# EAGLE design board_v3 (EAGLE 9.6.2)
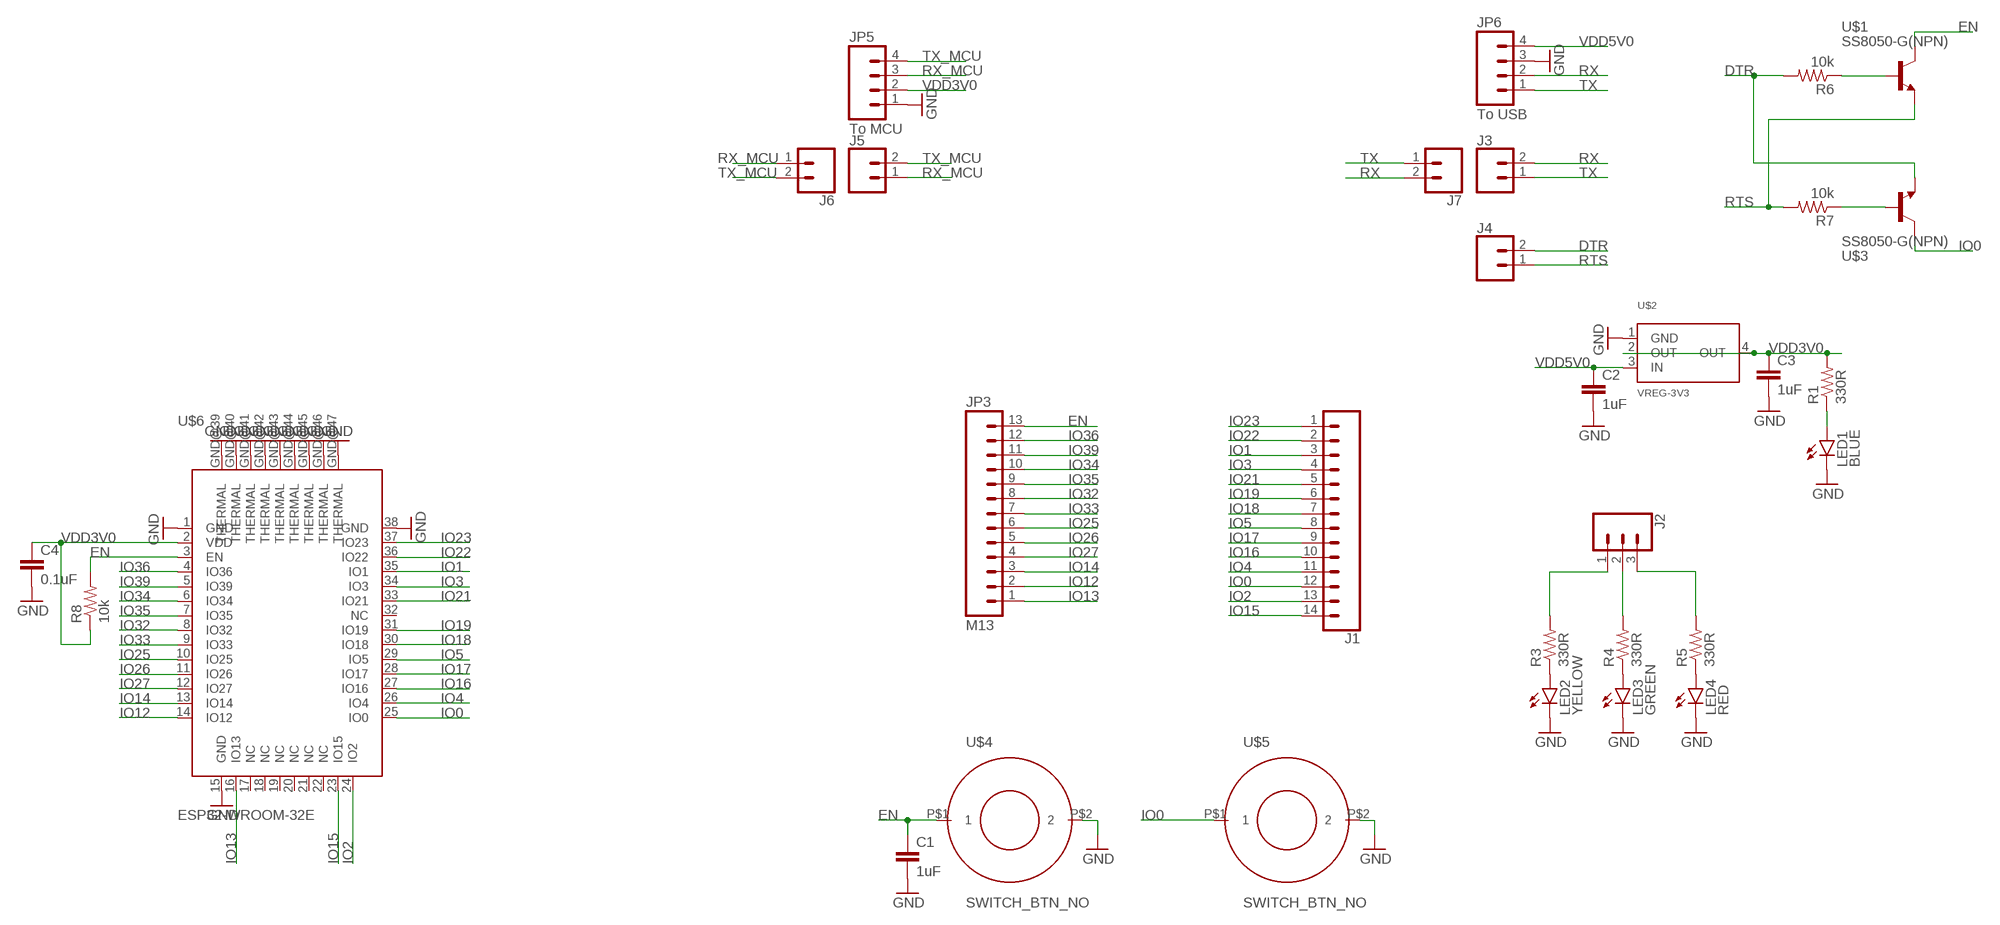
[diagram p0: schematic, sheet 1]

## Parts
C1  1uF  CAP  [0805]
C2  1uF  CAP  [0805]
C3  1uF  CAP  [0805]
C4  0.1uF  CAP  [0805]
J1  CONN_14  [1X14]
J2  CONN_03  [1X03]
J3  CONN_02  [1X02]
J4  CONN_02  [1X02]
J5  CONN_02  [1X02]
J6  CONN_02  [1X02]
J7  CONN_02  [1X02]
JP3  M13  [1X13]
JP5  To MCU  M04PTH  [1X04]
JP6  To USB  M04PTH  [1X04]
LED1  BLUE  LED0603  [LED-0603]
LED2  YELLOW  LED0603  [LED-0603]
LED3  GREEN  LED0603  [LED-0603]
LED4  RED  LED0603  [LED-0603]
R1  330R  RES  [0805]
R3  330R  RES  [0805]
R4  330R  RES  [0805]
R5  330R  RES  [0805]
R6  10k  RES  [0805]
R7  10k  RES  [0805]
R8  10k  RES  [0805]
U$1  SS8050-G(NPN)  [SOT-23(SS8050-G)]
U$2  VREG-3V3  [R-PDSO-G4_TI]
U$3  SS8050-G(NPN)  [SOT-23(SS8050-G)]
U$4  SWITCH_BTN_NO  [BTN_2]
U$5  SWITCH_BTN_NO  [BTN_2]
U$6  ESP32-WROOM-32E  [ESP32-WROOM-32E]

## Nets
DTR: J4.2 R6.2 U$3.2(E)
EN: C1.1 JP3.13 R8.2 U$1.3(C) U$4.P$1 U$6.3(EN)
GND: C1.2 C2.2 C3.2 C4.2 JP5.1 JP6.3 LED1.C LED2.C LED3.C LED4.C U$2.1(GND) U$4.P$2 U$5.P$2 U$6.1(GND) U$6.15(GND) U$6.38(GND) U$6.GND@39(THERMAL) U$6.GND@40(THERMAL) U$6.GND@41(THERMAL) U$6.GND@42(THERMAL) U$6.GND@43(THERMAL) U$6.GND@44(THERMAL) U$6.GND@45(THERMAL) U$6.GND@46(THERMAL) U$6.GND@47(THERMAL)
IO0: J1.12 U$3.3(C) U$5.P$1 U$6.25(IO0)
IO1: J1.3 U$6.35(IO1)
IO2: J1.13 U$6.24(IO2)
IO3: J1.4 U$6.34(IO3)
IO4: J1.11 U$6.26(IO4)
IO5: J1.8 U$6.29(IO5)
IO12: JP3.2 U$6.14(IO12)
IO13: JP3.1 U$6.16(IO13)
IO14: JP3.3 U$6.13(IO14)
IO15: J1.14 U$6.23(IO15)
IO16: J1.10 U$6.27(IO16)
IO17: J1.9 U$6.28(IO17)
IO18: J1.7 U$6.30(IO18)
IO19: J1.6 U$6.31(IO19)
IO21: J1.5 U$6.33(IO21)
IO22: J1.2 U$6.36(IO22)
IO23: J1.1 U$6.37(IO23)
IO25: JP3.6 U$6.10(IO25)
IO26: JP3.5 U$6.11(IO26)
IO27: JP3.4 U$6.12(IO27)
IO32: JP3.8 U$6.8(IO32)
IO33: JP3.7 U$6.9(IO33)
IO34: JP3.10 U$6.6(IO34)
IO35: JP3.9 U$6.7(IO35)
IO36: JP3.12 U$6.4(IO36)
IO39: JP3.11 U$6.5(IO39)
N$1: LED1.A R1.1
N$2: J2.1 R3.2
N$3: J2.3 R5.2
N$4: J2.2 R4.2
N$7: R6.1 U$1.1(B)
N$8: R7.1 U$3.1(B)
N$13: LED2.A R3.1
N$14: LED3.A R4.1
N$15: LED4.A R5.1
RTS: J4.1 R7.2 U$1.2(E)
RX: J3.2 J7.2 JP6.2
RX_MCU: J5.1 J6.1 JP5.3
TX: J3.1 J7.1 JP6.1
TX_MCU: J5.2 J6.2 JP5.4
VDD3V0: C3.1 C4.1 JP5.2 R1.2 R8.1 U$2.2(OUT) U$2.4(OUT) U$6.2(VDD)
VDD5V0: C2.1 JP6.4 U$2.3(IN)
Unconnected: U$6.17(NC) U$6.18(NC) U$6.19(NC) U$6.20(NC) U$6.21(NC) U$6.22(NC) U$6.32(NC)

## Library data of the parts
C1-C4 = Ilya_Teach:CAP
J1 = SparkFun-Connectors:CONN_14: Multi connection point. Often used as Generic Header-pin footprint for 0.1 inch spaced/style header connections On any of the 0.1 inch spaced packages, you can populate with these: Break Away Headers - Straight <https://www.sparkfun.com/products/116> (PRT-00116) Break Away Male Headers - Right Angle <https://www.sparkfun.com/products/553> (PRT-00553) Female Headers <https://www.sparkfun.com/products/115> (PRT-00115) Break Away Headers - Machine Pin <https://www.sparkfun.com/products/117> (PRT-00117) Break Away Female Headers - Swiss Machine Pin <https://www.sparkfun.com/products/743> (PRT-00743) For SCREWTERMINALS and SPRING TERMINALS visit here: Screw Terimnals on SparkFun.com <https://www.sparkfun.com/search/results?term=Screw+Terminals> (5mm/3.5mm/2.54mm spacing) This device is also useful as a general connection point to wire up your design to another part of your project. Our various solder wires solder well into these plated through hole pads. Hook-Up Wire - Assortment (Stranded, 22 AWG) <https://www.sparkfun.com/products/11375> (PRT-11375) Hook-Up Wire - Assortment (Solid Core, 22 AWG) <https://www.sparkfun.com/products/11367> (PRT-11367) View the entire wire category on our website here <https://www.sparkfun.com/categories/141> Special notes: Molex polarized connector foot print use with SKU : PRT-08231 with associated crimp pins and housings. 1MM SMD Version SKU: PRT-10208 NOTES ON THE VARIANTS LOCK and LOCK_LONGPADS... This footprint was designed to help hold the alignment of a through-hole component (i.e. 6-pin header) while soldering it into place. You may notice that each hole has been shifted either up or down by 0.005 of an inch from it's more standard position (which is a perfectly straight line). This slight alteration caused the pins (the squares in the middle) to touch the edges of the holes. Because they are alternating, it causes a "brace" to hold the component in place. 0.005 has proven to be the perfect amount of "off-center" position when using our standard breakaway headers. Although looks a little odd when you look at the bare footprint, once you have a header in there, the alteration is very hard to notice. Also,if you push a header all the way into place, it is covered up entirely on the bottom side.
J2 = SparkFun-Connectors:CONN_03: Multi connection point. Often used as Generic Header-pin footprint for 0.1 inch spaced/style header connections On any of the 0.1 inch spaced packages, you can populate with these: Break Away Headers - Straight <https://www.sparkfun.com/products/116> (PRT-00116) Break Away Male Headers - Right Angle <https://www.sparkfun.com/products/553> (PRT-00553) Female Headers <https://www.sparkfun.com/products/115> (PRT-00115) Break Away Headers - Machine Pin <https://www.sparkfun.com/products/117> (PRT-00117) Break Away Female Headers - Swiss Machine Pin <https://www.sparkfun.com/products/743> (PRT-00743) Stackable Header - 3 Pin (Female, 0.1") <https://www.sparkfun.com/products/13875> (PRT-13875) For SCREWTERMINALS and SPRING TERMINALS visit here: Screw Terimnals on SparkFun.com <https://www.sparkfun.com/search/results?term=Screw+Terminals> (5mm/3.5mm/2.54mm spacing) This device is also useful as a general connection point to wire up your design to another part of your project. Our various solder wires solder well into these plated through hole pads. Hook-Up Wire - Assortment (Stranded, 22 AWG) <https://www.sparkfun.com/products/11375> (PRT-11375) Hook-Up Wire - Assortment (Solid Core, 22 AWG) <https://www.sparkfun.com/products/11367> (PRT-11367) View the entire wire category on our website here <https://www.sparkfun.com/categories/141> Special notes: Molex polarized connector foot print use with SKU : PRT-08232 with associated crimp pins and housings.
J3-J7 = SparkFun-Connectors:CONN_02: Multi connection point. Often used as Generic Header-pin footprint for 0.1 inch spaced/style header connections On any of the 0.1 inch spaced packages, you can populate with these: Break Away Headers - Straight <https://www.sparkfun.com/products/116> (PRT-00116) Break Away Male Headers - Right Angle <https://www.sparkfun.com/products/553> (PRT-00553) Female Headers <https://www.sparkfun.com/products/115> (PRT-00115) Break Away Headers - Machine Pin <https://www.sparkfun.com/products/117> (PRT-00117) Break Away Female Headers - Swiss Machine Pin <https://www.sparkfun.com/products/743> (PRT-00743) For SCREWTERMINALS and SPRING TERMINALS visit here: Screw Terimnals on SparkFun.com <https://www.sparkfun.com/search/results?term=Screw+Terminals> (5mm/3.5mm/2.54mm spacing) This device is also useful as a general connection point to wire up your design to another part of your project. Our various solder wires solder well into these plated through hole pads. Hook-Up Wire - Assortment (Stranded, 22 AWG) <https://www.sparkfun.com/products/11375> (PRT-11375) Hook-Up Wire - Assortment (Solid Core, 22 AWG) <https://www.sparkfun.com/products/11367> (PRT-11367) View the entire wire category on our website here <https://www.sparkfun.com/categories/141> Special notes: Molex polarized connector foot print use with: PRT-08233 with associated crimp pins and housings. 2.54_SCREWTERM for use with PRT-10571. 3.5mm Screw Terminal footprints for PRT-08084 5mm Screw Terminal footprints for use with PRT-08432
JP3 = SparkFun:M13
JP5 JP6 = SparkFun:M04: Header 4 Standard 4-pin 0.1" header. Use with straight break away headers (SKU : PRT-00116), right angle break away headers (PRT-00553), swiss pins (PRT-00743), machine pins (PRT-00117), and female headers (PRT-00115). Molex polarized connector foot print use with SKU : PRT-08231 with associated crimp pins and housings. 1MM SMD Version SKU: PRT-10208
LED1-LED4 = Ilya_Teach:LED: LEDs Standard schematic elements and footprints for 5mm, 3mm, 1206, and 0603 sized LEDs. 5mm - Spark Fun Electronics SKU : COM-00529 (and others)
R1 R3-R8 = Ilya_Teach:RES
U$1 U$3 = Ilya_Teach:SS8050-G(NPN)
U$2 = Ilya_Teach:VREG-3V3
U$4 U$5 = Ilya_Teach:SWITCH_BTN_NO
U$6 = Ilya_Teach:ESP32-WROOM-32E

## Board
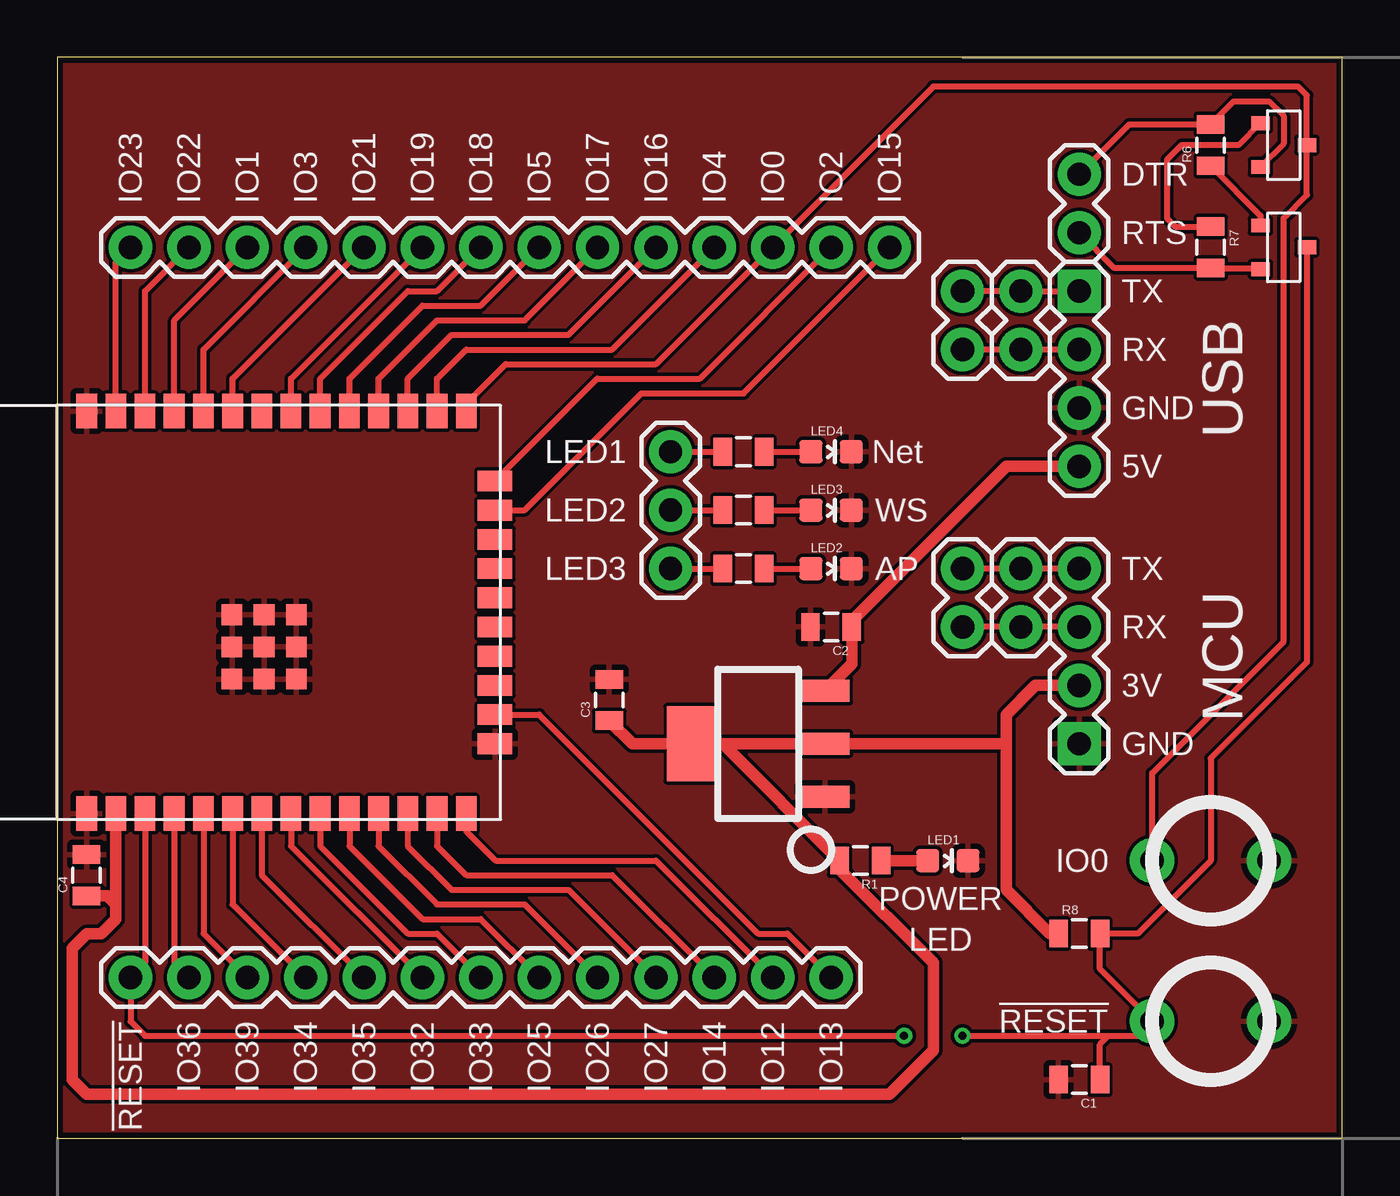
[diagram p1: board, top side]
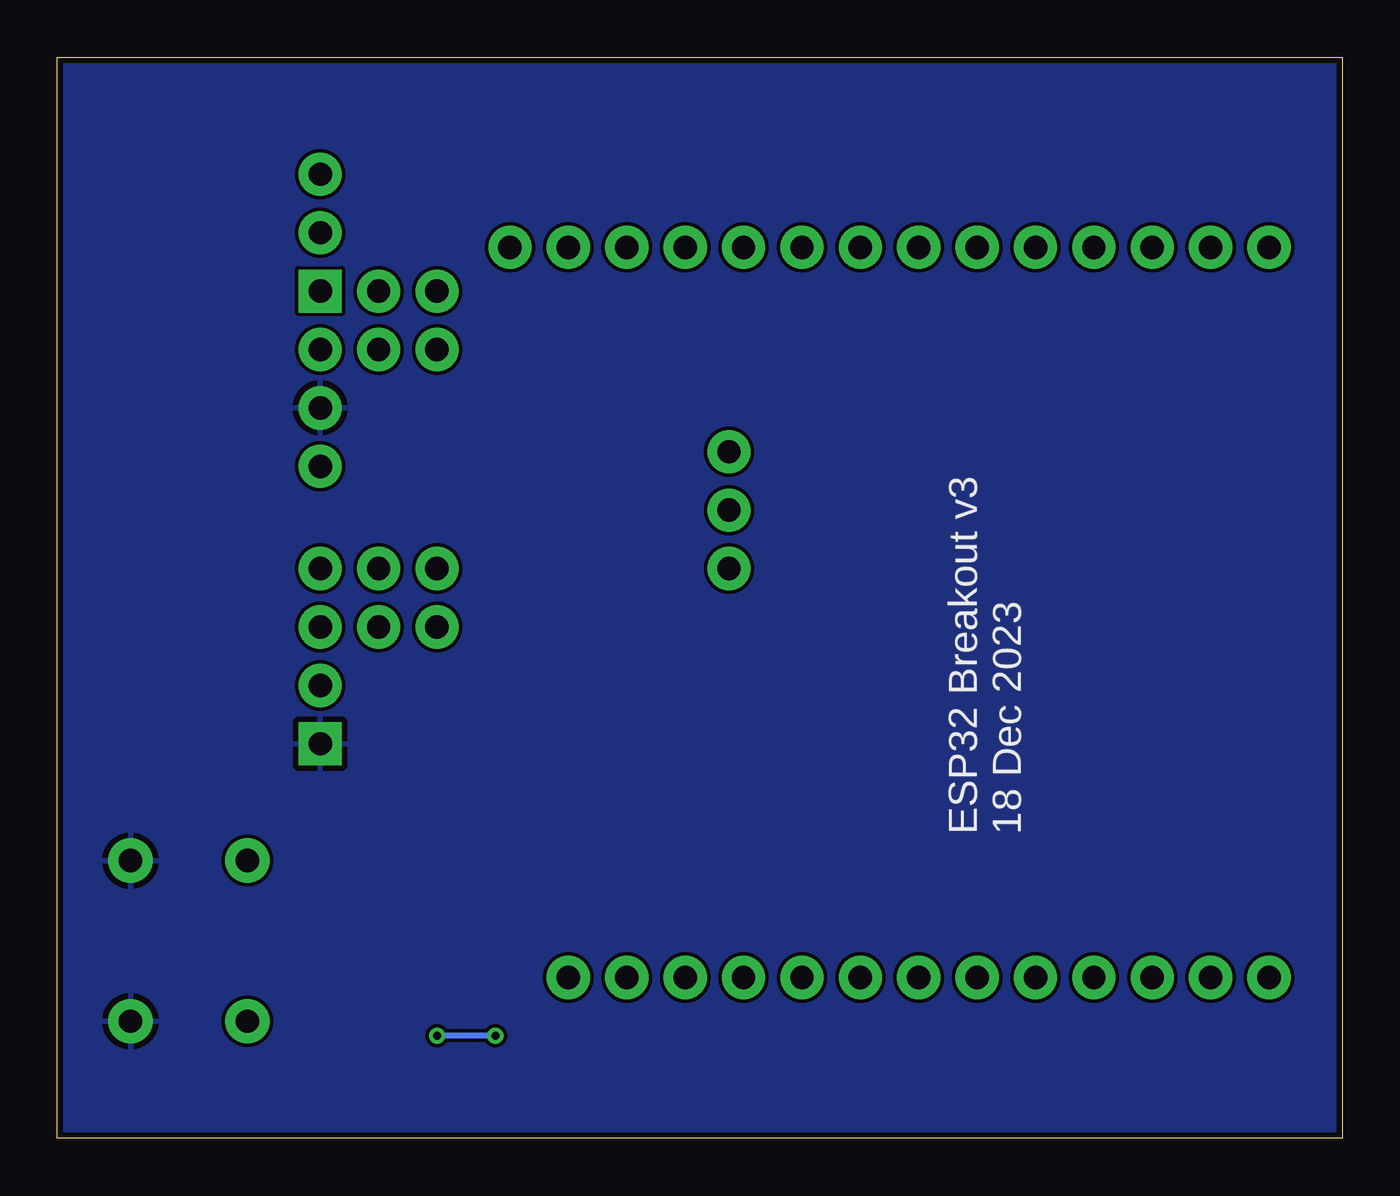
[diagram p2: board, bottom side, seen from below]

Size 55.88 x 46.99 mm. Coordinates in mm from the lower left corner, seen from the top.
Outline: 0,0 55.88,0 55.88,46.99 0,46.99 0,0
Copper layers (1*16): Top 0.0356mm / dielectric 1.5011mm / Bottom 0.0356mm
Design rules "LaenPCBOrder *": minimum track width 6mil, minimum drill 13mil, track to track 6mil, track to pad 6mil, pad to pad 6mil, via to via 6mil, smd to smd 6mil, copper to edge 10mil, drill to drill 6mil, minimum pad ring 7mil, minimum via ring 7mil, stop-mask expansion 4mil, vias tented up to drill 0mil, thermal gap 10mil

### Footprints (pad centres in the part's own frame; a part is rotated, then mirrored left to right if it is on the bottom)
0805 = smd 0.8 x 1.2: 1 -0.9,0; 2 0.9,0
1X14 = drill 1.016 pad 1.88: 1 0,0; 2 2.54,0; 3 5.08,0; 4 7.62,0; 5 10.16,0; 6 12.7,0; 7 15.24,0; 8 17.78,0; 9 20.32,0; 10 22.86,0; 11 25.4,0; 12 27.94,0; 13 30.48,0; 14 33.02,0
1X03 = drill 1.016 pad 1.88: 1 0,0; 2 2.54,0; 3 5.08,0
1X02 = drill 1.016 pad 1.88: 1 0,0; 2 2.54,0
1X13 = drill 1.016 pad 1.88: 1 0,0; 2 2.54,0; 3 5.08,0; 4 7.62,0; 5 10.16,0; 6 12.7,0; 7 15.24,0; 8 17.78,0; 9 20.32,0; 10 22.86,0; 11 25.4,0; 12 27.94,0; 13 30.48,0
1X04 = drill 1.016 pad 1.88 square: 1 0,0 | drill 1.016 pad 1.88: 2 2.54,0; 3 5.08,0; 4 7.62,0
LED-0603 = smd 1 x 1: A 0,-0.877; C 0,0.877
SOT-23(SS8050-G) = smd 0.6 x 0.8: 1 -0.95,-1.01; 2 0.95,-1.01; 3 0,1.01
R-PDSO-G4_TI = smd 0.95 x 2.15: 1 -2.3,-2.9; 2 0,-2.9; 3 2.3,-2.9 | smd 3.25 x 2.15: 4 0,2.9
BTN_2 = drill 1.016 pad 1.93: P$1 -2.54,0; P$2 2.54,0
ESP32-WROOM-32E = smd 1.5 x 0.9: 1 -8.75,8.255; 2 -8.75,6.985; 3 -8.75,5.715; 4 -8.75,4.445; 5 -8.75,3.175; 6 -8.75,1.905; 7 -8.75,0.635; 8 -8.75,-0.635; 9 -8.75,-1.905; 10 -8.75,-3.175; 11 -8.75,-4.445; 12 -8.75,-5.715; 13 -8.75,-6.985; 14 -8.75,-8.255; 25 8.75,-8.255; 26 8.75,-6.985; 27 8.75,-5.715; 28 8.75,-4.445; 29 8.75,-3.175; 30 8.75,-1.905; 31 8.75,-0.635; 32 8.75,0.635; 33 8.75,1.905; 34 8.75,3.175; 35 8.75,4.445; 36 8.75,5.715; 37 8.75,6.985; 38 8.75,8.255 | smd 0.9 x 1.5: 15 -5.715,-9.505; 16 -4.445,-9.505; 17 -3.175,-9.505; 18 -1.905,-9.505; 19 -0.635,-9.505; 20 0.635,-9.505; 21 1.905,-9.505; 22 3.175,-9.505; 23 4.445,-9.505; 24 5.715,-9.505 | smd 0.9 x 0.9: GND@39 -2.9,1.935; GND@40 -1.5,1.935; GND@41 -0.1,1.935; GND@42 -2.9,0.535; GND@43 -1.5,0.535; GND@44 -0.1,0.535; GND@45 -2.9,-0.865; GND@46 -1.5,-0.865; GND@47 -0.1,-0.865

### Placement (x,y rotation side)
C1  44.45,2.54 180 top
C2  33.66,22.23 180 top
C3  24,19.05 90 top
C4  1.27,11.43 90 top
J1  3.17,38.73 0 top
J2  26.67,24.77 90 top
J3  41.91,36.83 270 top
J4  44.45,39.37 90 top
J5  41.91,22.23 90 top
J6  39.37,22.23 90 top
J7  39.37,36.83 270 top
JP3  33.66,6.99 180 top
JP5  44.45,17.14 90 top
JP6  44.45,36.83 270 top
LED1  38.73,12.06 270 top
LED2  33.66,24.77 270 top
LED3  33.66,27.3 270 top
LED4  33.66,29.84 270 top
R1  34.92,12.06 180 top
R3  29.84,24.77 180 top
R4  29.84,27.3 180 top
R5  29.84,29.84 180 top
R6  50.16,43.18 90 top
R7  50.16,38.73 270 top
R8  44.45,8.89 0 top
U$1  53.34,38.73 270 top
U$2  30.48,17.14 90 top
U$3  53.34,43.18 270 top
U$4  50.16,5.08 0 top
U$5  50.16,12.06 0 top
U$6  9.53,22.86 90 top

### Tracks (layer width: path | path; a pad name or v marks a point on that pad's centre or on a via)
DTR
  Top 0.254: U$3.2 53.34,43.24 53.34,44.45 52.7,45.09 51.17,45.09 R6.2 46.62,44.08 J4.2
EN  (via drill 0.35)
  Top 0.254: U$1.3 54.35,20.7 50.16,16.51 50.16,12.06 46.99,8.89 R8.2 45.35,7.36 U$4.P$1 46.99,4.45 45.72,4.45 | v36.83,4.45 3.81,4.45 3.17,5.08 JP3.13 3.81,7.62 U$6.3 | v39.37,4.45 45.72,4.45 | C1.1 45.35,4.08 45.72,4.45
  Bottom 0.254: v36.83,4.45 v39.37,4.45
GND
  pour Bottom: 0,0 55.88,0 55.88,46.99 0,46.99
  pour Top: 0,0 55.88,0 55.88,46.99 0,46.99
IO0
  Top 0.254: U$5.P$1 47.62,15.88 53.34,21.59 53.34,40.01 54.35,41.02 U$3.3 54.35,45.34 53.98,45.72 38.1,45.72 J1.12 26.04,33.66 19.5,33.66 17.78,31.94 U$6.25
IO1
  Top 0.254: U$6.35 5.08,35.56 J1.3
IO2
  Top 0.254: J1.13 27.94,33.02 23.48,33.02 U$6.24
IO3
  Top 0.254: U$6.34 6.35,34.29 J1.4
IO4
  Top 0.254: J1.11 24.13,34.29 17.78,34.29 16.51,33.02 U$6.26
IO5
  Top 0.254: J1.8 18.41,36.2 15.88,36.2 12.7,33.02 U$6.29
IO12
  Top 0.254: JP3.2 26.04,12.06 19.05,12.06 17.78,13.34 U$6.14
IO13
  Top 0.254: JP3.1 31.75,8.89 30.48,8.89 20.95,18.41 U$6.16
IO14
  Top 0.254: JP3.3 24.13,11.43 17.78,11.43 16.51,12.7 U$6.13
IO15
  Top 0.254: J1.14 29.84,32.38 25.4,32.38 20.32,27.3 U$6.23
IO16
  Top 0.254: J1.10 22.23,34.92 17.14,34.92 15.24,33.02 U$6.27
IO17
  Top 0.254: J1.9 20.32,35.56 16.51,35.56 13.97,33.02 U$6.28
IO18
  Top 0.254: J1.7 16.51,36.83 15.24,36.83 11.43,33.02 U$6.30
IO19
  Top 0.254: U$6.31 10.16,33.02 J1.6
IO21
  Top 0.254: U$6.33 7.62,33.02 J1.5
IO22
  Top 0.254: U$6.36 3.81,36.83 J1.2
IO23
  Top 0.254: U$6.37 2.54,38.1 J1.1
IO25
  Top 0.254: JP3.6 18.41,9.53 15.88,9.53 12.7,12.7 U$6.10
IO26
  Top 0.254: JP3.5 20.32,10.16 16.51,10.16 13.97,12.7 U$6.11
IO27
  Top 0.254: JP3.4 22.23,10.79 17.14,10.79 15.24,12.7 U$6.12
IO32
  Top 0.254: U$6.8 10.16,12.7 JP3.8
IO33
  Top 0.254: JP3.7 16.51,8.89 15.24,8.89 11.43,12.7 U$6.9
IO34
  Top 0.254: U$6.6 7.62,10.16 JP3.10
IO35
  Top 0.254: U$6.7 8.89,11.43 JP3.9
IO36
  Top 0.254: U$6.4 5.08,7.62 JP3.12
IO39
  Top 0.254: U$6.5 6.35,8.89 JP3.11
N$1
  Top 0.508: LED1.A R1.1
N$2
  Top 0.254: J2.1 R3.2
N$3
  Top 0.254: J2.3 R5.2
N$4
  Top 0.254: J2.2 R4.2
N$7
  Top 0.254: R6.1 52.33,40.12 U$1.1
N$8
  Top 0.254: U$3.1 51.38,43.18 48.9,43.18 48.26,42.55 48.26,40.01 48.63,39.63 R7.1
N$13
  Top 0.254: R3.1 LED2.A
N$14
  Top 0.254: R4.1 LED3.A
N$15
  Top 0.254: R5.1 LED4.A
RTS
  Top 0.254: J4.1 45.98,37.84 R7.2 52.28,37.84 U$1.2
RX
  Top 0.254: JP6.2 J3.2 J7.2
RX_MCU
  Top 0.254: JP5.3 J5.1 J6.1
TX
  Top 0.254: JP6.1 J3.1 J7.1
TX_MCU
  Top 0.254: JP5.4 J5.2 J6.2
VDD3V0
  Top 0.508: U$2.4 28.95,17.14 R1.2 34.02,11.7 38.1,7.62 38.1,3.81 36.2,1.91 1.27,1.91 0.64,2.54 0.64,8.26 1.27,8.89 1.91,8.89 2.54,9.53 2.54,10.16 | U$2.4 U$2.2 41.27,17.14 | JP5.2 42.55,19.68 41.27,18.41 41.27,17.14 | U$6.2 2.54,10.16 | C4.1 2.17,10.53 2.54,10.16 | R8.1 43.18,8.89 41.27,10.79 41.27,17.14 | U$2.4 25.01,17.14 C3.1
VDD5V0
  Top 0.508: JP6.4 41.27,29.21 34.55,22.49 C2.1 34.55,20.62 U$2.3

### Text on the board
tPlace: DTR | IO23 | IO22 | IO1 | IO3 | IO21 | IO19 | IO18 | IO5 | IO17 | IO16 | IO4 | IO0 | IO2 | IO15 | RTS | TX | RX | USB | GND | LED1 | Net | 5V | LED2 | WS | LED3 | AP | TX | RX | MCU | 3V | GND | IO0 | POWER | LED | !RESET | IO36 | IO39 | IO34 | IO35 | IO32 | IO33 | IO25 | IO26 | IO27 | IO14 | IO12 | IO13 | !RESET
bPlace: ESP32 Breakout v3 / 18 Dec 2023